# Altium schematic sheet HV_BUCK.SchDoc (part 2 of 2)
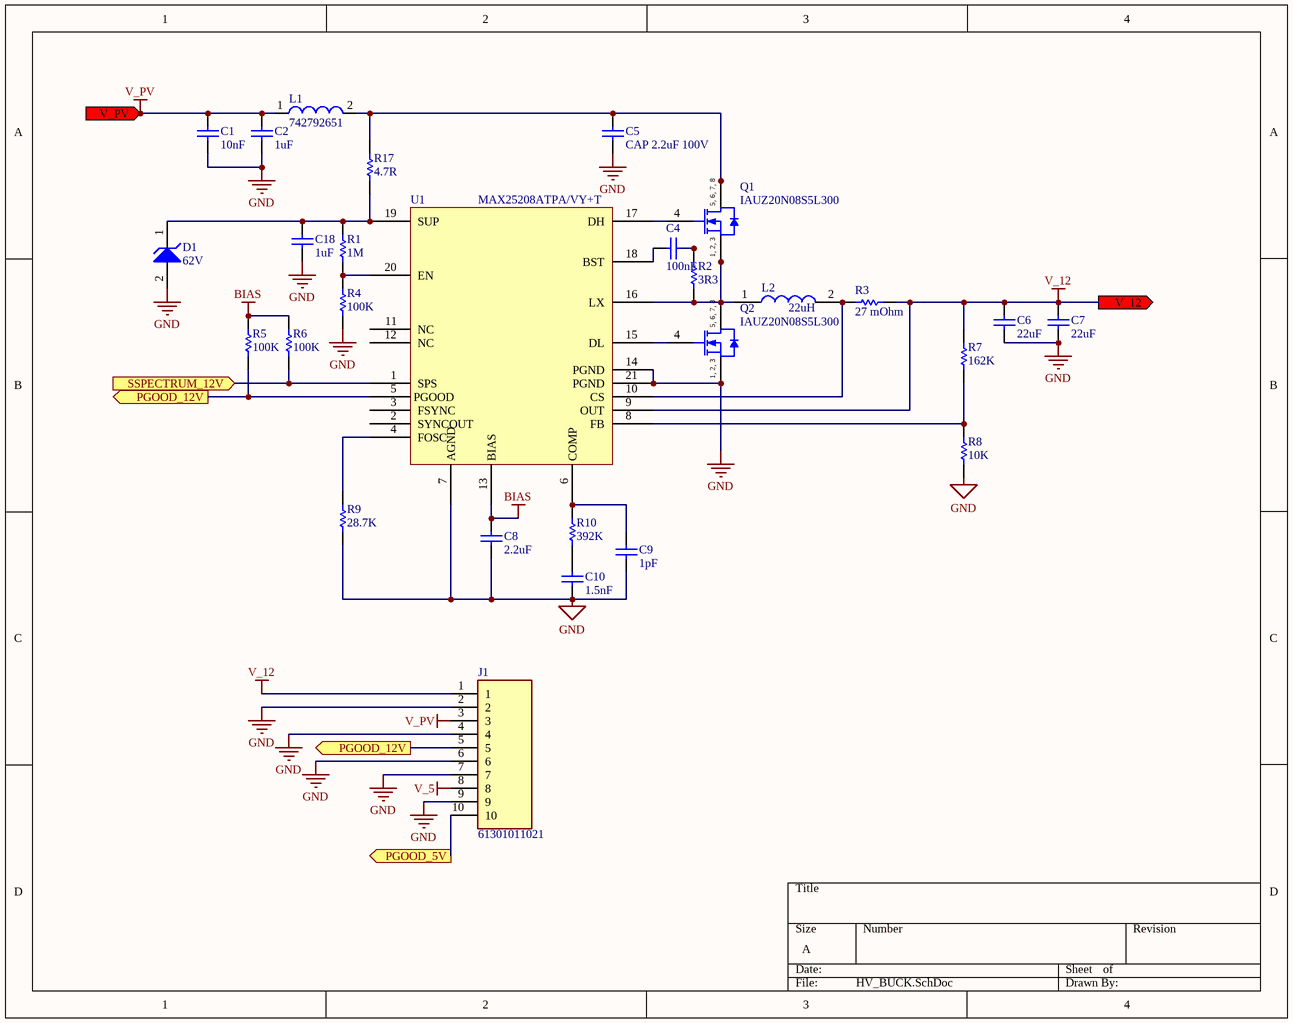
[diagram p1: HV_BUCK.SchDoc]

## Notes on the sheet
- (in symbol CMP-1091-00311-1) 5, 6, 7, 8; 1, 2, 3

## Library data of the parts
C1 = CMP-2007-04169-1: Cap Ceramic 0.01uF 100V X7R 10% SMD 0805 FlexiTerm 125C Paper T/R; Manufacturer: AVX Interconnect / Elco; Part Number: 08051C103KAZ2A; Dissipation Factor: 2.5%; Temperature Coefficient: 30ppm/°C; Supplier 1: Digi-Key; Supplier Part Number 1: 478-3559-1-ND; Manufacturer Part Number: 08051C103KAZ2A; RoHS: Yes; Category: Ceramic Capacitors; Stock 1: 40; Pricing 1: 1=0.27000, 10=0.18200, 50=0.10880, 100=0.09200, 500=0.06292, 1000=0.05566 (USD); Mount: Surface Mount; Case/Package: 0805; Number of Pins: 2; Case Code (Metric): 2012; Case Code (Imperial): 0805; Min Operating Temperature: -55°C; Max Operating Temperature: 125°C; Capacitance: 10nF; Tolerance: 10%; Packaging: Tape and Reel; Package Quantity: 1; Dielectric: X7R; Series: FLEXITERM®; Voltage Rating: 100V; Voltage Rating (DC): 100V; Termination: SMD/SMT; Construction: Flat; Voltage: 100V; Features: Soft Termination; Length: 2.01mm; Width: 0.049inch; Height: 0.94mm; Depth: 1.25mm; Thickness: 0.037inch; Radiation Hardening: No; RoHS Compliant: Yes; REACH SVHC: No SVHC; Lead Free: Lead Free; ComponentLink1URL: https://datasheet.ciiva.com/26904/getdatasheetpartid-136837-26904192.pdf?src-supplier=Verical; ComponentLink1Description: https://datasheet.ciiva.com/26904/getdatasheetpartid-136837-26904192.pdf?src-supplier=Verical; ComponentLink2URL: https://datasheet.ciiva.com/11787/0900766b80dc2409-11787665.pdf?src-supplier=RSComponents; ComponentLink2Description: https://datasheet.ciiva.com/11787/0900766b80dc2409-11787665.pdf?src-supplier=RSComponents; ComponentLink3URL: https://datasheet.ciiva.com/151/flexiterm-151492.pdf?src-supplier=Digi-Key; ComponentLink3Description: https://datasheet.ciiva.com/151/flexiterm-151492.pdf?src-supplier=Digi-Key; ComponentLink4URL: https://datasheet.ciiva.com/151/flexiterm-151493.pdf?src-supplier=Digi-Key; ComponentLink4Description: https://datasheet.ciiva.com/151/flexiterm-151493.pdf?src-supplier=Digi-Key; ComponentLink5URL: https://datasheet.ciiva.com/16326/cx7r-16326741.pdf?src-supplier=Future+Electronics; ComponentLink5Description: https://datasheet.ciiva.com/16326/cx7r-16326741.pdf?src-supplier=Future+Electronics; ComponentLink6URL: https://datasheet.ciiva.com/151/flexiterm-151494.pdf?src-supplier=Digi-Key; ComponentLink6Description: https://datasheet.ciiva.com/151/flexiterm-151494.pdf?src-supplier=Digi-Key; ComponentLink7URL: https://datasheet.ciiva.com/16625/flexiterm-16625227.pdf?src-supplier=Avnet+Europe; ComponentLink7Description: https://datasheet.ciiva.com/16625/flexiterm-16625227.pdf?src-supplier=Avnet+Europe; ComponentLink8URL: https://datasheet.ciiva.com/11508/flexiterm-11508220.pdf?src-supplier=Avnet; ComponentLink8Description: https://datasheet.ciiva.com/11508/flexiterm-11508220.pdf?src-supplier=Avnet; ComponentLink9URL: https://datasheet.ciiva.com/5416/cx7r-218113-5416686.pdf?src-supplier=Mouser; ComponentLink9Description: https://datasheet.ciiva.com/5416/cx7r-218113-5416686.pdf?src-supplier=Mouser
C2 = CMP-1037-04728-2: Chip Capacitor, 1 uF, +/- 10%, 100 V, -55 to 125 degC, 1206 (3216 Metric), RoHS, Tape and Reel; Manufacturer: AVX; Capacitance: 1µF; Dielectric: X7R; Rated Voltage: 100V; Mounting Technology: SurfaceMount; Package Description: 2-Pin Surface Mount Device, Body 3.2 x 1.6 mm; Case Size/Dimension: 1206; Datasheet Version: 07/2016; Manufacturer URL: http://www.avx.com/; Package Reference: 1206; Datasheet URL: http://datasheets.avx.com/X7RDielectric.pdf; Tolerance (%): ±10%
C4 = CMP-2008-02800-1: AVX 0.1uF Multilayer Ceramic Capacitor (MLCC) 16 V dc 10% X7R dielectric 402 SMT max op. temp. +125C; Manufacturer: AVX Interconnect / Elco; Part Number: 0402YC104KAT2A; Voltage Rating: 16V; Supplier 1: Digi-Key; Supplier Part Number 1: 478-7888-1-ND; Manufacturer Part Number: 0402YC104KAT2A; RoHS: Yes; Category: Ceramic Capacitors; Stock 1: 72315; Pricing 1: 1=0.10000, 10=0.01600, 50=0.00860, 100=0.00700, 500=0.00500, 1000=0.00393, 2500=0.00358, 5000=0.00329 (USD); Mount: Surface Mount,PCB; Case/Package: 0402; Case Code (Metric): 1005; Case Code (Imperial): 0402; Dielectric Material: Ceramic; Contact Plating: Tin,Matte; Min Operating Temperature: -55°C; Max Operating Temperature: 125°C; Tolerance: 10%; Packaging: Tape and Reel; Capacitance: 100nF; Voltage Rating (DC): 16V; Dielectric: X7R; Voltage: 16V; Package Quantity: 1; Termination: SMD/SMT; Series: -; Construction: Flat; Length: 1mm; Width: 0.02inch; Height: 0.56mm; Thickness: 0.022inch; Depth: 0.5mm; Radiation Hardening: No; REACH SVHC: Unknown; RoHS Compliant: Yes; Lead Free: Lead Free; ComponentLink1URL: https://datasheet.ciiva.com/1123/1679506-1123956.pdf?src-supplier=Element14; ComponentLink1Description: https://datasheet.ciiva.com/1123/1679506-1123956.pdf?src-supplier=Element14; ComponentLink2URL: https://datasheet.ciiva.com/7614/cx7r-7614662.pdf?src-supplier=Digi-Key; ComponentLink2Description: https://datasheet.ciiva.com/7614/cx7r-7614662.pdf?src-supplier=Digi-Key; ComponentLink3URL: https://datasheet.ciiva.com/22693/1679506-22693578.pdf?src-supplier=Element14; ComponentLink3Description: https://datasheet.ciiva.com/22693/1679506-22693578.pdf?src-supplier=Element14; ComponentLink4URL: https://datasheet.ciiva.com/16623/cx7r-16623291.pdf?src-supplier=Avnet+Europe; ComponentLink4Description: https://datasheet.ciiva.com/16623/cx7r-16623291.pdf?src-supplier=Avnet+Europe; ComponentLink5URL: https://datasheet.ciiva.com/2987/cx7r-2987708.pdf?src-supplier=Avnet; ComponentLink5Description: https://datasheet.ciiva.com/2987/cx7r-2987708.pdf?src-supplier=Avnet; ComponentLink6URL: https://datasheet.ciiva.com/6265/cx7r-6265276.pdf?src-supplier=Digi-Key; ComponentLink6Description: https://datasheet.ciiva.com/6265/cx7r-6265276.pdf?src-supplier=Digi-Key; ComponentLink7URL: https://datasheet.ciiva.com/28613/1679506-28613260.pdf?src-supplier=Element14; ComponentLink7Description: https://datasheet.ciiva.com/28613/1679506-28613260.pdf?src-supplier=Element14; ComponentLink8URL: https://datasheet.ciiva.com/5411/cx7r-218113-5411197.pdf?src-supplier=Mouser; ComponentLink8Description: https://datasheet.ciiva.com/5411/cx7r-218113-5411197.pdf?src-supplier=Mouser; ComponentLink9URL: https://datasheet.ciiva.com/7709/1679506-7709566.pdf?src-supplier=Element14; ComponentLink9Description: https://datasheet.ciiva.com/7709/1679506-7709566.pdf?src-supplier=Element14
C5 = CMP-1038-02104-1: CAP 2.2uF 100V ±10% 1210 (3225 Metric) Thickness 2.8mm SMD; Case-Metric: 3225; Tolerance: Â±10%; Case-EIA: 1210; Rated Voltage: 100 V; Value: 2.2uF; Technology: SMT; Max Thickness: 2.8 mm
C6 C7 = CMP-2000-05478-1: Ceramic Capacitor, 25 V, 22 uF, +/-10%, -55 to 85 degC, 2-Pin SMD (1210), RoHS, Tape and Reel; Temperature Coefficient / Code: +/-15%; Case Height: 2.79mm; Brand: AVX; Case Width: 2.5mm; Tolerance: 10%; Voltage Rating: 25V; Dielectric: X5R; Case Length: 3.2mm; Type: StandardX5RMLCCs; Case Code - in: 1210; Packaging: Reel; Minimum Operating Temperature: -55C; Package Reference: 1210; Product Category: MultilayerCeramicCapacitorsMLCC-SMD/SMT; Package / Case: 1210(3225metric); Dimensions: 2.5mmWx3.2mmLx2.79mmH; Capacitance: 22uF; RoHS: Details; Manufacturer: AVX; Case Code - mm: 3225; Maximum Operating Temperature: +85C; Operating Temperature Range: -55Cto+85C; Mounting Technology: SurfaceMount; Product: GeneralTypeMLCCs; Manufacturer URL: http://www.avx.com/; Termination Style: SMD/SMT; Package Description: 2-Pin Surface Mount Device, Body 3.2 x 2.5 mm; Datasheet URL: http://datasheets.avx.com/cx5r.pdf; Datasheet Version: 05/2016; Voltage Rating DC: 25V; Factory Pack Quantity: 1000
C8 = CMP-2007-03455-1: Manufacturer: Murata; Part Number: GRM21BR71C225KA12L; Tolerance: 10%; Voltage Rating: 16V; Dielectric: X7R; Supplier 1: Digi-Key; Supplier Part Number 1: 490-3906-1-ND; Manufacturer Part Number: GRM21BR71C225KA12L; RoHS: Yes; Category: Ceramic Capacitors; Stock 1: 321; Pricing 1: 1=0.33000, 10=0.23000, 50=0.15300, 100=0.13010, 500=0.09184, 1000=0.08036 (USD); Mount: Surface Mount; Case/Package: 0805; Number of Pins: 2; Case Code (Imperial): 0805; Case Code (Metric): 2012; Min Operating Temperature: -55°C; Max Operating Temperature: 125°C; Capacitance: 2.2uF; Packaging: Tape and Reel; Voltage Rating (DC): 16V; Package Quantity: 1; Termination: SMD/SMT; Voltage: 16V; Series: GRM; Construction: Flat; Length: 2mm; Width: 1.25mm; Height: 1.25mm; Thickness: 0.053inch; Depth: 1.25mm; Radiation Hardening: No; REACH SVHC: No SVHC; RoHS Compliant: Yes; Lead Free: Lead Free; ComponentLink1URL: https://datasheet.ciiva.com/3777/97grm21br71c225ka1223-3777119.pdf?src-supplier=Arrow+Electronics; ComponentLink1Description: https://datasheet.ciiva.com/3777/97grm21br71c225ka1223-3777119.pdf?src-supplier=Arrow+Electronics; ComponentLink2URL: https://datasheet.ciiva.com/7937/608985-7937701.pdf?src-supplier=Element14; ComponentLink2Description: https://datasheet.ciiva.com/7937/608985-7937701.pdf?src-supplier=Element14; ComponentLink3URL: https://datasheet.ciiva.com/5416/product-5416103.pdf?src-supplier=Mouser; ComponentLink3Description: https://datasheet.ciiva.com/5416/product-5416103.pdf?src-supplier=Mouser; ComponentLink4URL: https://datasheet.ciiva.com/11615/product-11615451.pdf?src-supplier=Avnet; ComponentLink4Description: https://datasheet.ciiva.com/11615/product-11615451.pdf?src-supplier=Avnet; ComponentLink5URL: https://datasheet.ciiva.com/16440/product-16440619.pdf?src-supplier=Future+Electronics; ComponentLink5Description: https://datasheet.ciiva.com/16440/product-16440619.pdf?src-supplier=Future+Electronics; ComponentLink6URL: https://datasheet.ciiva.com/137/partnumbering-e-01-137677.pdf?src-supplier=Digi-Key; ComponentLink6Description: https://datasheet.ciiva.com/137/partnumbering-e-01-137677.pdf?src-supplier=Digi-Key; ComponentLink7URL: https://datasheet.ciiva.com/137/partnumbering-e-01-137678.pdf?src-supplier=Digi-Key; ComponentLink7Description: https://datasheet.ciiva.com/137/partnumbering-e-01-137678.pdf?src-supplier=Digi-Key; ComponentLink8URL: https://datasheet.ciiva.com/137/partnumbering-e-01-137679.pdf?src-supplier=Digi-Key; ComponentLink8Description: https://datasheet.ciiva.com/137/partnumbering-e-01-137679.pdf?src-supplier=Digi-Key
C9 = CMP-2100-03588-1: Chip Capacitor, 1 pF, +/- 0.25 pF, 50 V, -55 to 125 degC, 0402 (1005 Metric), RoHS, Tape and Reel; Manufacturer: Yageo; Manufacturer Part Number: CC0402CRNPO9BN1R0; Tolerance: 5%; Dielectric: C0G; Insulation Resistance: 100GR; Voltage Rating: 50V; Dielectric Material: Ceramic; Min Operating Temperature: -55degC; Manufacturer URL: http://www.yageo.com/; Radiation Hardening: No; Capacitance: 1pF; Width: 0.02inch; REACH SVHC: NoSVHC; Termination: SMD/SMT; Composition: Ceramic; Mount: SurfaceMount; Height: 0.5mm; Case Code (Imperial): 0402; Thickness: 0.022inch; Case Code (Metric): 1005; Lead Free: LeadFree; Voltage Rating (DC): 50V; Length: 1mm; Depth: 0.5mm; Package Description: 2-Pin Surface Mount Device, Body 1 x 0.5 mm; Case/Package: 0402; Datasheet URL: http://www.yageo.com/documents/recent/UPY-GP_NP0_16V-to-50V_14.pdf; Packaging: TapeandReel; Max Operating Temperature: 125degC; Package Quantity: 10000; Package Reference: 0402; RoHSCompliant: True; Datasheet Version: Rev. 14, 07/2016; Supplier 1: Digi-Key; Supplier Part Number 1: 311-2076-1-ND; RoHS: Yes; Category: Ceramic Capacitors; Stock 1: 254020; Pricing 1: 1=0.10000, 10=0.02700, 50=0.01500, 100=0.01220, 500=0.00870, 1000=0.00683, 2500=0.00621, 5000=0.00571 (USD); Series: CC; Construction: Flat; Resistor Type: Ceramic; RoHS Compliant: Yes; ComponentLink1URL: https://datasheet.ciiva.com/17437/upy-gp-np0-16v-to-50v-8-17437445.pdf?src-supplier=Avnet+Europe; ComponentLink1Description: https://datasheet.ciiva.com/17437/upy-gp-np0-16v-to-50v-8-17437445.pdf?src-supplier=Avnet+Europe; ComponentLink2URL: https://datasheet.ciiva.com/8033/1443161-8033590.pdf?src-supplier=Element14; ComponentLink2Description: https://datasheet.ciiva.com/8033/1443161-8033590.pdf?src-supplier=Element14; ComponentLink3URL: https://datasheet.ciiva.com/11587/upy-gp-np0-16v-to-50v-8-11587159.pdf?src-supplier=Avnet; ComponentLink3Description: https://datasheet.ciiva.com/11587/upy-gp-np0-16v-to-50v-8-11587159.pdf?src-supplier=Avnet; ComponentLink4URL: https://datasheet.ciiva.com/17437/upy-gp-np0-16v-to-50v-8-17437447.pdf?src-supplier=Avnet+Europe; ComponentLink4Description: https://datasheet.ciiva.com/17437/upy-gp-np0-16v-to-50v-8-17437447.pdf?src-supplier=Avnet+Europe; ComponentLink5URL: https://datasheet.ciiva.com/176/mlccorderingcode-176344.pdf?src-supplier=Digi-Key; ComponentLink5Description: https://datasheet.ciiva.com/176/mlccorderingcode-176344.pdf?src-supplier=Digi-Key; ComponentLink6URL: https://datasheet.ciiva.com/7656/1132289-7656600.pdf?src-supplier=Element14; ComponentLink6Description: https://datasheet.ciiva.com/7656/1132289-7656600.pdf?src-supplier=Element14; ComponentLink7URL: https://datasheet.ciiva.com/11587/upy-gp-np0-16v-to-50v-8-11587161.pdf?src-supplier=Avnet; ComponentLink7Description: https://datasheet.ciiva.com/11587/upy-gp-np0-16v-to-50v-8-11587161.pdf?src-supplier=Avnet; ComponentLink8URL: https://datasheet.ciiva.com/13389/upy-gp-np0-16v-to-50v-8-13389355.pdf?src-supplier=Mouser; ComponentLink8Description: https://datasheet.ciiva.com/13389/upy-gp-np0-16v-to-50v-8-13389355.pdf?src-supplier=Mouser
C10 = CMP-2008-04642-1: Part Number: GRM155R71H152KA01D; Manufacturer: Murata; Material: Ceramic; Tolerance: 10%; Voltage Rating: 50V; Dielectric: X7R; Supplier 1: Digi-Key; Supplier Part Number 1: 490-3245-1-ND; Manufacturer Part Number: GRM155R71H152KA01D; RoHS: Yes; Category: Ceramic Capacitors; Stock 1: 353359; Pricing 1: 1=0.10000, 10=0.02200, 50=0.01180, 100=0.00960, 500=0.00686, 1000=0.00538, 2500=0.00490, 5000=0.00450 (USD); Mount: Surface Mount; Case/Package: 0402; Number of Pins: 2; Case Code (Imperial): 0402; Case Code (Metric): 1005; Min Operating Temperature: -55°C; Max Operating Temperature: 125°C; Capacitance: 1.5nF; Packaging: Tape and Reel; Package Quantity: 10000; Voltage Rating (DC): 50V; Termination: SMD/SMT; Voltage: 50V; Length: 1mm; Width: 0.5mm; Height: 0.5mm; Thickness: 0.022inch; Depth: 0.5mm; Radiation Hardening: No; RoHS Compliant: Yes; Lead Free: Lead Free; REACH SVHC: No SVHC; ComponentLink1URL: https://datasheet.ciiva.com/18184/getdatasheetpartid-153042-18184727.pdf?src-supplier=Verical; ComponentLink1Description: https://datasheet.ciiva.com/18184/getdatasheetpartid-153042-18184727.pdf?src-supplier=Verical; ComponentLink2URL: https://datasheet.ciiva.com/19476/1856441-19476519.pdf?src-supplier=Jameco; ComponentLink2Description: https://datasheet.ciiva.com/19476/1856441-19476519.pdf?src-supplier=Jameco; ComponentLink3URL: https://datasheet.ciiva.com/129/grm155r71h152ka01-01-129756.pdf?src-supplier=Digi-Key; ComponentLink3Description: https://datasheet.ciiva.com/129/grm155r71h152ka01-01-129756.pdf?src-supplier=Digi-Key; ComponentLink4URL: https://datasheet.ciiva.com/129/grm155r71h152ka01-01-129757.pdf?src-supplier=Digi-Key; ComponentLink4Description: https://datasheet.ciiva.com/129/grm155r71h152ka01-01-129757.pdf?src-supplier=Digi-Key; ComponentLink5URL: https://datasheet.ciiva.com/129/grm155r71h152ka01-01-129758.pdf?src-supplier=Digi-Key; ComponentLink5Description: https://datasheet.ciiva.com/129/grm155r71h152ka01-01-129758.pdf?src-supplier=Digi-Key; ComponentLink6URL: https://datasheet.ciiva.com/29199/454238-da-01-en-vs-kondensator-0402-29199743.pdf?src-supplier=Conrad; ComponentLink6Description: https://datasheet.ciiva.com/29199/454238-da-01-en-vs-kondensator-0402-29199743.pdf?src-supplier=Conrad; ComponentLink7URL: https://datasheet.ciiva.com/22698/608985-22698421.pdf?src-supplier=Element14; ComponentLink7Description: https://datasheet.ciiva.com/22698/608985-22698421.pdf?src-supplier=Element14; ComponentLink8URL: https://datasheet.ciiva.com/7937/608985-7937626.pdf?src-supplier=Element14; ComponentLink8Description: https://datasheet.ciiva.com/7937/608985-7937626.pdf?src-supplier=Element14; ComponentLink9URL: https://datasheet.ciiva.com/2989/product-2989403.pdf?src-supplier=Avnet; ComponentLink9Description: https://datasheet.ciiva.com/2989/product-2989403.pdf?src-supplier=Avnet; ComponentLink10URL: https://datasheet.ciiva.com/14116/grmseries-highdielectrictype-eng-14116907.pdf?src-supplier=Distrelec; ComponentLink10Description: https://datasheet.ciiva.com/14116/grmseries-highdielectrictype-eng-14116907.pdf?src-supplier=Distrelec; ComponentLink11URL: https://datasheet.ciiva.com/16199/product-16199179.pdf?src-supplier=Future+Electronics; ComponentLink11Description: https://datasheet.ciiva.com/16199/product-16199179.pdf?src-supplier=Future+Electronics; ComponentLink12URL: https://datasheet.ciiva.com/14116/grmseries-highdielectrictype-eng-14116846.pdf?src-supplier=Distrelec; ComponentLink12Description: https://datasheet.ciiva.com/14116/grmseries-highdielectrictype-eng-14116846.pdf?src-supplier=Distrelec
C18 = CMP-2000-05454-1: Chip Capacitor, 1 uF, +/- 10%, 100 V, -55 to 125 degC, 0805 (2012 Metric), RoHS, Tape and Reel; PCN Part Number: MLCCPartNumberChange30/Nov/2012; Manufacturer: TDK; Manufacturer Part Number: C2012X7S2A105K125AB; Other Names: 445-5205-1; Online Catalog: CSeries,MidVoltage; Capacitance: 1µF; Voltage - Rated: 100V; Temperature Coefficient: X7S; Featured Product: Compact,High-CapacitanceMultilayerCeramicChipCapacitorsMidVoltageX7S-100VMLCCsC-SeriesMidVoltageMLCCs; Kits: 445-9009-KIT-ND-KITCAPCERHICAP100V-630VSMDSAMPLEKIT1008-ND-KITCAPCERMLCC100V-630V; Catalog Drawings: CSERIES_2012-0805_1.45; Product Training Modules: SEAT,CCV,andTVCLDesignToolsCSeriesMidVoltageCapacitorsFamilyGuidetoReplacinganElectrolyticCapacitorwithanMLCC; Manufacturer URL: http://www.tdk.com/; Series: C; Ratings: -; Datasheet Version: Sep-13; Operating Temperature: -55degC~125degC; Lead Spacing: -; RoHS Information: RoHSCertificate-MLCC; Mounting Type: SurfaceMount,MLCC; Package Reference: 805; Thickness (Max): 0.053"(1.35mm); Category: Capacitors; Lead Style: -; Package Description: 2-Pin Surface Mount Device, Body 2 x 1.25 mm; Family: CeramicCapacitors; Features: -; Applications: GeneralPurpose; Package / Case: 0805(2012Metric); Standard Package: 1; Size / Dimension: 0.079"Lx0.049"W(2.00mmx1.25mm); Height - Seated (Max): -; Datasheet URL: https://datasheet.ciiva.com/24216/c2012x7s2a105k125ab-265082-24216433.pdf; Tolerance: ±10%; Packaging: CutTape(CT); Supplier 1: Digi-Key; Supplier Part Number 1: 445-5205-1-ND; RoHS: Yes; Stock 1: 274957; Pricing 1: 1=0.50000, 10=0.34500, 50=0.24160, 100=0.20700, 500=0.15524, 1000=0.13110 (USD); Mount: Surface Mount; Case/Package: 0805; Number of Pins: 2; Case Code (Imperial): 0805; Case Code (Metric): 2012; Weight: 0.000194oz; Min Operating Temperature: -55°C; Max Operating Temperature: 125°C; Voltage Rating: 100V; Voltage Rating (DC): 100V; Dielectric: X7S; Package Quantity: 1; Termination: SMD/SMT; Resistor Type: Ceramic; Voltage: 100V; Length: 2mm; Width: 1.25mm; Height: 1.25mm; Thickness: 0.053inch; Depth: 1.25mm; RoHS Compliant: Yes; Lead Free: Lead Free; REACH SVHC: No SVHC; ComponentLink1URL: https://datasheet.ciiva.com/24216/c2012x7s2a105k125ab-265082-24216433.pdf?src-supplier=Mouser; ComponentLink1Description: https://datasheet.ciiva.com/24216/c2012x7s2a105k125ab-265082-24216433.pdf?src-supplier=Mouser; ComponentLink2URL: https://datasheet.ciiva.com/16427/newmlccproducts-16427795.pdf?src-supplier=Future+Electronics; ComponentLink2Description: https://datasheet.ciiva.com/16427/newmlccproducts-16427795.pdf?src-supplier=Future+Electronics; ComponentLink3URL: https://datasheet.ciiva.com/8079/1833281-8079405.pdf?src-supplier=Element14; ComponentLink3Description: https://datasheet.ciiva.com/8079/1833281-8079405.pdf?src-supplier=Element14
D1 = CMP-1060-00431-1: Zener Voltage Regulator, 500 mW, 2-Pin SOD-123, Pb-Free, Tape and Reel; Manufacturer: On Semiconductor; PartNumber: SZMMSZ5265BT1G; VZ Typ (V): 62; P Max (W): 0.5; Max Power Dissipation: 500mW; Element Configuration: Single; Max Reverse Leakage Current: 100nA; Tolerance: 5%; Impedance: 185R; Test Current: 2mA; Packing: Tape and Reel; ComponentLink2URL: http://www.onsemi.cn/pub_link/Collateral/MMSZ5221BT1-D.PDF; DatasheetVersion: Rev. 12; Mounting Technology: Surface Mount; ComponentLink2Description: Datasheet; ComponentLink1Description: Manufacturer URL; ComponentLink3Description: Package Specification; ComponentLink1URL: http://www.onsemi.com/; PackageVersion: Rev. G, 10/2009; RoHS: Pb-Free; PackageDescription: 2-Pin SOD, Body 1.6 x 2.69 mm; ComponentLink3URL: http://www.onsemi.com/pub_link/Collateral/425-04.PDF; PackageReference: SOD-123-2-425-04; Supplier 1: Digi-Key; Supplier Part Number 1: SZMMSZ5265BT1GOSCT-ND; Manufacturer Part Number: SZMMSZ5265BT1G; Category: Zener Diodes; Stock 1: 15621; Pricing 1: 1=0.37000, 10=0.25800, 100=0.13010, 500=0.10614, 1000=0.07875 (USD); Case/Package: SOD-123-2; Number of Pins: 2; Min Operating Temperature: -55°C; Max Operating Temperature: 150°C; Package Quantity: 3000; Packaging: Tape and Reel; Zener Voltage: 62V; Voltage Tolerance: 5%; Length: 2.84mm; Width: 1.8mm; Height: 1.25mm; Radiation Hardening: No; Lead Free: Lead Free; RoHS Compliant: Yes; ComponentLink4URL: https://datasheet.ciiva.com/900/mmsz5221bt1-d-900256.pdf?src-supplier=Digi-Key; ComponentLink4Description: https://datasheet.ciiva.com/900/mmsz5221bt1-d-900256.pdf?src-supplier=Digi-Key; ComponentLink5URL: https://datasheet.ciiva.com/10638/mmsz5221bt1-d-10638351.pdf?src-supplier=Avnet; ComponentLink5Description: https://datasheet.ciiva.com/10638/mmsz5221bt1-d-10638351.pdf?src-supplier=Avnet
J1 = 61301011021: Connector; Manufacturer_Name: Wurth Elektronik; Datasheet Link: http://katalog.we-online.de/em/datasheet/6130xx11021.pdf; Height: 2.54mm; Manufacturer_Part_Number: 61301011021; Mouser Part Number: 710-61301011021; Mouser Price/Stock: https://www.mouser.co.uk/ProductDetail/Wurth-Elektronik/61301011021/?qs=ZtY9WdtwX54YO5vJhQZSew%3D%3D
L1 = CMP-0220-00181-1: SMD EMI Suppression Ferrite Bead WE-CBF, Z = 600 Ohm; Manufacturer: Wurth Electronics; Impedance: 600 Ohm; Tolerance: 25%; Current Rating: 1A; Number of Lines: 1; DC Resistance (DCR): 200mR; Test Frequency: 100MHz; Inductance: 0.36H; PackageReference: SMD-0603; PackageVersion: 2009; ComponentLink2Description: Datasheet; ComponentLink1Description: Manufacturer Link; ComponentLink2URL: http://www.we-online.de/katalog/media/pdf/742792651.pdf; DatasheetVersion: Dec-2005; ComponentLink1URL: http://www.we-online.com; PackageDescription: Chip Inductor, 2-Leads, Body 1.6 x 0.8 mm; Supplier 1: Digi-Key; Supplier Part Number 1: 732-1593-1-ND; Manufacturer Part Number: 742792651; RoHS: Yes; Category: Ferrite Beads and Chips; Stock 1: 132361; Pricing 1: 1=0.17000, 50=0.16800, 100=0.15500, 500=0.14800, 1000=0.14100, 2000=0.13400 (USD); Mount: Surface Mount; Case/Package: SMD/SMT; Core Material: Ferrite; Case Code (Metric): 1608; Case Code (Imperial): 0603; Material: Ferrite; Weight: 0.000141oz; Min Operating Temperature: -55°C; Max Operating Temperature: 125°C; Package Quantity: 1; Packaging: Tape and Reel; Max Current Rating: 1A; Max DC Current: 1A; Termination: SMD/SMT; Series: WE-CBF; Resistance: 200mR; Length: 1.6mm; Width: 0.8mm; Height: 0.8mm; Depth: 0.8mm; REACH SVHC: Unknown; RoHS Compliant: Yes; Lead Free: Lead Free; ComponentLink3URL: https://datasheet.ciiva.com/11803/0900766b80d2e079-11803680.pdf?src-supplier=RSComponents; ComponentLink3Description: https://datasheet.ciiva.com/11803/0900766b80d2e079-11803680.pdf?src-supplier=RSComponents; ComponentLink4URL: https://datasheet.ciiva.com/1475/1705833-1475349.pdf?src-supplier=Farnell; ComponentLink4Description: https://datasheet.ciiva.com/1475/1705833-1475349.pdf?src-supplier=Farnell; ComponentLink5URL: https://datasheet.ciiva.com/1013/742792651-1013527.pdf?src-supplier=Digi-Key; ComponentLink5Description: https://datasheet.ciiva.com/1013/742792651-1013527.pdf?src-supplier=Digi-Key; ComponentLink6URL: https://datasheet.ciiva.com/4940/742792651-72243-4940492.pdf?src-supplier=Mouser; ComponentLink6Description: https://datasheet.ciiva.com/4940/742792651-72243-4940492.pdf?src-supplier=Mouser; ComponentLink7URL: https://datasheet.ciiva.com/1013/742792651-1013528.pdf?src-supplier=Digi-Key; ComponentLink7Description: https://datasheet.ciiva.com/1013/742792651-1013528.pdf?src-supplier=Digi-Key; ComponentLink8URL: https://datasheet.ciiva.com/1013/742792651-1013529.pdf?src-supplier=Digi-Key; ComponentLink8Description: https://datasheet.ciiva.com/1013/742792651-1013529.pdf?src-supplier=Digi-Key; ComponentLink9URL: https://datasheet.ciiva.com/22711/1705833-22711420.pdf?src-supplier=Element14; ComponentLink9Description: https://datasheet.ciiva.com/22711/1705833-22711420.pdf?src-supplier=Element14
L2 = MPX1D0840L470: Inductor 22uH; Manufacturer_Name: Kemet; Manufacturer_Part_Number: MPX1D0840L220; Datasheet Link: https://componentsearchengine.com/Datasheets/1/MPX1D0840L470.pdf; Height: 4mm; Mouser Part Number: 80-MPX1D0840L220; Mouser Price/Stock: https://www.mouser.com/Search/Refine.aspx?Keyword=80-MPX1D0840L470
Q1 Q2 = CMP-1091-00311-1: N-Channel OptiMOS 3 Power-Transistor, 80 V VDS, 23 A ID, -55 to 150 degC, PG-TSDSON-8-1, Reel, Green; Manufacturer: Infineon; IDpuls (max): 92Â A; Green: TRUE; VGS(th) (min): 2Â V; QG: 6.8Â nC; Ptot (max): 32Â W; RDS (on) (max): 34Â mOhm; RDS (on) (max) (@4.5V): 66Â mOhm; Rth: 3.9Â K/W; VGS(th) (max): 3.5Â V; RthJA (max): 60 K/W; Polarity: N; ID (max): 23Â A; VDS (max): 80Â V; PackageVersion: Rev. 02, 09/2008; PackageReference: PG-TSDSON-8-1; PackageDescription: 8-Pin Plastic (Green) Thin Dual Small Outline Non-Leaded Package, 3.3 x 3.3 mm Body, 0.65 mm Pitch; DatasheetVersion: Rev. 2.3; PartNumber: IAUZ20N08S5L300; Mounting Technology: Surface Mount; ComponentLink1Description: Manufacturer URL; ComponentLink2Description: Datasheet; ComponentLink3URL: http://www.infineon.com/dgdl/BSZ240N12NS3+Rev2.0.pdf?folderId=db3a304313b8b5a60113cee8763b02d7&fileId=db3a30432a40a650012a42f3057a0038; Packing: Reel; ComponentLink1URL: http://www.infineon.com/; RthJC (max): 3.9Â K/W; ComponentLink3Description: Package Specification; Halogen-free: TRUE; ComponentLink2URL: http://www.infineon.com/dgdl/BSZ340N08NS3G_rev2.3.pdf?folderId=db3a304313b8b5a60113cee8763b02d7&fileId=db3a30431ff9881501206626660b6c72
R1 = CMP-2000-04829-1: RES SMD 1M OHM 1% 1/10W 0603; Manufacturer: Yageo; Part Number: AC0603FR-071ML; Resistance: 1MR; Power Rating: 100mW; Temperature Coefficient: 100ppm/°C; Voltage Rating: 50V; Supplier 1: Digi-Key; Supplier Part Number 1: 311-1MLDCT-ND; Manufacturer Part Number: AC0603FR-071ML; RoHS: Yes; Category: Chip SMD Resistors; Stock 1: 1569; Pricing 1: 1=0.10000, 10=0.02900, 100=0.01170, 1000=0.00527, 2500=0.00458 (USD); Case/Package: 0603; Case Code (Metric): 1608; Case Code (Imperial): 0603; Min Operating Temperature: -55°C; Max Operating Temperature: 155°C; Tolerance: 1%; Packaging: Tape and Reel; Resistor Type: Thick Film; Number of Terminations: 2; Max Power Dissipation: 100mW; Series: AC; Package Quantity: 1; Termination: SMD/SMT; Features: Moisture Resistant,Automotive AEC-Q200,Anti-Sulfur; Length: 0.063inch; Width: 0.031inch; Height: 0.022inch; RoHS Compliant: Yes; Lead Free: Lead Free; ComponentLink1URL: https://datasheet.ciiva.com/5562/pyu-ac-51-rohs-l-2-5562551.pdf?src-supplier=Mouser; ComponentLink1Description: https://datasheet.ciiva.com/5562/pyu-ac-51-rohs-l-2-5562551.pdf?src-supplier=Mouser
R2 = CMP-2002-07060-1: Res Thick Film 0402 3.3 Ohm 1% 1/16W ±200ppm/°C Molded SMD Paper T/R; Manufacturer: Yageo / Phycomp; Part Number: RC0402FR-073R3L; Power Rating: 63mW; Resistance: 3.3R; Voltage Rating: 50V; Supplier 1: Digi-Key; Supplier Part Number 1: 311-3.30LRCT-ND; Manufacturer Part Number: RC0402FR-073R3L; RoHS: Yes; Category: Chip SMD Resistors; Stock 1: 461211; Pricing 1: 1=0.10000, 10=0.02400, 100=0.00960, 1000=0.00431, 2500=0.00374, 5000=0.00309 (USD); Case/Package: 0402; Case Code (Imperial): 0402; Case Code (Metric): 1005; Contact Plating: Tin,Matte; Size Code: 0402; Min Operating Temperature: -55°C; Max Operating Temperature: 155°C; Tolerance: 1%; Packaging: Tape and Reel; Resistor Type: Thick Film; Temperature Coefficient: 200ppm/°C; Series: RC; Max Power Dissipation: 63mW; Number of Terminations: 2; Construction: Rectangular; Voltage Rating (DC): 50V; Features: Moisture Resistant; Termination: SMD/SMT; Resistance Tolerance: 1%; Length: 1mm; Depth: 0.5mm; RoHS Compliant: Yes; Military Standard: Not; Lead Free: Lead Free; REACH SVHC: Unknown; ComponentLink1URL: https://datasheet.ciiva.com/28412/pyu-rc0402-51-rohs-l-6-28412729.pdf?src-supplier=Avnet+Europe; ComponentLink1Description: https://datasheet.ciiva.com/28412/pyu-rc0402-51-rohs-l-6-28412729.pdf?src-supplier=Avnet+Europe; ComponentLink2URL: https://datasheet.ciiva.com/16856/pyu-rc0402-51-rohs-l-6-16856956.pdf?src-supplier=Avnet+Europe; ComponentLink2Description: https://datasheet.ciiva.com/16856/pyu-rc0402-51-rohs-l-6-16856956.pdf?src-supplier=Avnet+Europe; ComponentLink3URL: https://datasheet.ciiva.com/7849/1018594-7849999.pdf?src-supplier=Element14; ComponentLink3Description: https://datasheet.ciiva.com/7849/1018594-7849999.pdf?src-supplier=Element14; ComponentLink4URL: https://datasheet.ciiva.com/8893/pyu-rc0402-51-rohs-l-6-8893711.pdf?src-supplier=Avnet; ComponentLink4Description: https://datasheet.ciiva.com/8893/pyu-rc0402-51-rohs-l-6-8893711.pdf?src-supplier=Avnet
R3 = CMP-2003-04053-1: Manufacturer: Yageo; Part Number: RL1206FR-070R027L; Resistance: 27mR; Power Rating: 250mW; Tolerance: 1%; Temperature Coefficient: 1200ppm/°C; Supplier 1: Digi-Key; Supplier Part Number 1: 311-.027LWCT-ND; Manufacturer Part Number: RL1206FR-070R027L; RoHS: Yes; Category: Chip SMD Resistors; Stock 1: 6389; Pricing 1: 1=0.70000, 10=0.54000, 100=0.22710, 1000=0.12530, 2500=0.11747 (USD); Case/Package: 1206; Case Code (Imperial): 1206; Case Code (Metric): 3216; Weight: 0.000571oz; Min Operating Temperature: -55°C; Max Operating Temperature: 125°C; Packaging: Tape and Reel; Resistor Type: Thick Film; Termination: SMD/SMT; Package Quantity: 5000; Features: Moisture Resistant,Automotive AEC-Q200; Series: RL; Technology: THICK FILM; Max Power Dissipation: 250mW; Number of Terminations: 2; Construction: Rectangular; Length: 3.1mm; Width: 1.6mm; Height: 0.55mm; Depth: 1.6mm; Military Standard: Not; RoHS Compliant: Yes; ComponentLink1URL: https://datasheet.ciiva.com/15328/pyu-rl-521-rohs-l-5-15328789.pdf?src-supplier=Mouser; ComponentLink1Description: https://datasheet.ciiva.com/15328/pyu-rl-521-rohs-l-5-15328789.pdf?src-supplier=Mouser
R4 = CMP-2100-03662-1: Chip Resistor, 100 KOhm, +/- 1%, 0.1 W, -55 to 155 degC, 0603 (1608 Metric), RoHS, Tape and Reel; Manufacturer: Yageo; Manufacturer Part Number: RC0603FR-07100KL; Power Rating: 100mW; Voltage Rating: 50V; Temperature Coefficient: 100ppm/degreesC; Working Voltage: 75V; Datasheet Version: Rev. 5, 10/2016; Height: 0.45mm; Lead Free: LeadFree; Manufacturer URL: http://www.yageo.com/; Package Reference: 0603; Depth: 0.8mm; RoHSCompliant: true; Composition: ThickFilm; Military Standard: Not; Resistance: 100KOhm; Case/Package: 0603; Packaging: TapeandReel; Case Code (Imperial): 0603; Voltage Rating (DC): 50V; Case Code (Metric): 1608; Tolerance: 1%; Termination: SMD/SMT; Min Operating Temperature: -55degC; Number of Pins: 2; Length: 1.6mm; Width: 0.8mm; Datasheet URL: http://www.yageo.com/NewPortal/yageodocoutput?fileName=/pdf/R-Chip/PYu-RC_Group_51_RoHS_L_5.pdf; Package Description: 2-Pin Surface Mount Device, Body 1.6 x 0.8 mm; Max Operating Temperature: 155degC; REACH SVHC: NoSVHC; Supplier 1: Digi-Key; Supplier Part Number 1: 311-100KHRCT-ND; RoHS: Yes; Category: Chip SMD Resistors; Stock 1: 19737322; Pricing 1: 1=0.10000, 10=0.02400, 100=0.00970, 1000=0.00436, 2500=0.00378 (USD); Series: RC; Max Power Dissipation: 100mW; Resistor Type: Thick Film; Number of Terminations: 2; Resistance Tolerance: 1%; Features: Moisture Resistant; Construction: Rectangular; Technology: THICK FILM; RoHS Compliant: Yes; ComponentLink1URL: https://datasheet.ciiva.com/11808/0900766b80f96399-11808107.pdf?src-supplier=RSComponents; ComponentLink1Description: https://datasheet.ciiva.com/11808/0900766b80f96399-11808107.pdf?src-supplier=RSComponents; ComponentLink2URL: https://datasheet.ciiva.com/7983/443971-7983593.pdf?src-supplier=Element14; ComponentLink2Description: https://datasheet.ciiva.com/7983/443971-7983593.pdf?src-supplier=Element14; ComponentLink3URL: https://datasheet.ciiva.com/46440/1868787-46440889.pdf?src-supplier=Element14; ComponentLink3Description: https://datasheet.ciiva.com/46440/1868787-46440889.pdf?src-supplier=Element14; ComponentLink4URL: https://datasheet.ciiva.com/7746/1738695-7746234.pdf?src-supplier=Element14; ComponentLink4Description: https://datasheet.ciiva.com/7746/1738695-7746234.pdf?src-supplier=Element14; ComponentLink5URL: https://datasheet.ciiva.com/7746/1738695-7746235.pdf?src-supplier=Element14; ComponentLink5Description: https://datasheet.ciiva.com/7746/1738695-7746235.pdf?src-supplier=Element14; ComponentLink6URL: https://datasheet.ciiva.com/22747/443971-22747516.pdf?src-supplier=Element14; ComponentLink6Description: https://datasheet.ciiva.com/22747/443971-22747516.pdf?src-supplier=Element14
R5 R6 = CMP-2002-07343-1: Res General Purpose Thick Film 0402 100K Ohm 1% 1/16W ±100ppm/°C Molded SMD Paper T/R; Part Number: RC0402FR-07100KL; Manufacturer: Yageo / Phycomp; Power Rating: 63mW; Resistance: 100kR; Voltage Rating: 50V; Supplier 1: Digi-Key; Supplier Part Number 1: 311-100KLRCT-ND; Manufacturer Part Number: RC0402FR-07100KL; RoHS: Yes; Category: Chip SMD Resistors; Stock 1: 17727422; Pricing 1: 1=0.10000, 10=0.01600, 100=0.00640, 1000=0.00286, 2500=0.00248, 5000=0.00205 (USD); Case/Package: 0402; Case Code (Metric): 1005; Case Code (Imperial): 0402; Min Operating Temperature: -55°C; Max Operating Temperature: 155°C; Tolerance: 1%; Packaging: Tape and Reel; Max Power Dissipation: 63mW; Series: RC; Package Quantity: 1; Termination: SMD/SMT; Resistance Tolerance: 1%; Resistor Type: Thick Film; Number of Terminations: 2; Temperature Coefficient: 100ppm/°C; Construction: Rectangular; Features: Moisture Resistant; Technology: THICK FILM; Working Voltage: 50V; Length: 0.039inch; Width: 0.02inch; Height: 0.016inch; Depth: 0.5mm; RoHS Compliant: Yes; REACH SVHC: No SVHC; Military Standard: Not; Lead Free: Lead Free; ComponentLink1URL: https://datasheet.ciiva.com/11819/0900766b80c66297-11819452.pdf?src-supplier=RSComponents; ComponentLink1Description: https://datasheet.ciiva.com/11819/0900766b80c66297-11819452.pdf?src-supplier=RSComponents; ComponentLink2URL: https://datasheet.ciiva.com/2453/pyu-r-int-thick-7-2453361.pdf?src-supplier=Digi-Key; ComponentLink2Description: https://datasheet.ciiva.com/2453/pyu-r-int-thick-7-2453361.pdf?src-supplier=Digi-Key; ComponentLink3URL: https://datasheet.ciiva.com/2453/pyu-r-int-thick-7-2453362.pdf?src-supplier=Digi-Key; ComponentLink3Description: https://datasheet.ciiva.com/2453/pyu-r-int-thick-7-2453362.pdf?src-supplier=Digi-Key; ComponentLink4URL: https://datasheet.ciiva.com/2453/pyu-r-int-thick-7-2453363.pdf?src-supplier=Digi-Key; ComponentLink4Description: https://datasheet.ciiva.com/2453/pyu-r-int-thick-7-2453363.pdf?src-supplier=Digi-Key; ComponentLink5URL: https://datasheet.ciiva.com/22747/1018594-22747509.pdf?src-supplier=Element14; ComponentLink5Description: https://datasheet.ciiva.com/22747/1018594-22747509.pdf?src-supplier=Element14; ComponentLink6URL: https://datasheet.ciiva.com/15189/getdatasheetpartid-323696-15189334.pdf?src-supplier=Verical; ComponentLink6Description: https://datasheet.ciiva.com/15189/getdatasheetpartid-323696-15189334.pdf?src-supplier=Verical; ComponentLink7URL: https://datasheet.ciiva.com/12667/pyu-rc0402-51-rohs-l-6-r-12667930.pdf?src-supplier=Mouser; ComponentLink7Description: https://datasheet.ciiva.com/12667/pyu-rc0402-51-rohs-l-6-r-12667930.pdf?src-supplier=Mouser
R7 = CMP-2002-07134-1: Part Number: RC0402FR-07162KL; Manufacturer: Yageo / Phycomp; Resistance: 162kR; Tolerance: 1%; Power Rating: 62.5mW; Temperature Coefficient: 100ppm/°C; Voltage Rating: 50V; Max Power Dissipation: 63mW; Supplier 1: Digi-Key; Supplier Part Number 1: YAG2370CT-ND; Manufacturer Part Number: RC0402FR-07162KL; RoHS: Yes; Category: Chip SMD Resistors; Stock 1: 611980; Pricing 1: 1=0.10000, 10=0.01600, 100=0.00660, 1000=0.00299, 2500=0.00259, 5000=0.00214 (USD); Case/Package: 0402; Case Code (Imperial): 0402; Case Code (Metric): 1005; Contact Plating: Tin,Matte; Size Code: 0402; Min Operating Temperature: -55°C; Max Operating Temperature: 155°C; Packaging: Tape and Reel; Resistor Type: Thick Film; Package Quantity: 10000; Termination: SMD/SMT; Voltage Rating (DC): 50V; Series: RC; Number of Terminations: 2; Features: Moisture Resistant; Construction: Rectangular; Length: 1mm; Width: 0.02inch; Height: 0.016inch; Depth: 0.5mm; RoHS Compliant: Yes; Lead Free: Lead Free; Military Standard: Not; ComponentLink1URL: https://datasheet.ciiva.com/16869/pyu-rc0402-51-rohs-l-6-16869191.pdf?src-supplier=Avnet+Europe; ComponentLink1Description: https://datasheet.ciiva.com/16869/pyu-rc0402-51-rohs-l-6-16869191.pdf?src-supplier=Avnet+Europe; ComponentLink2URL: https://datasheet.ciiva.com/2452/pyu-r-int-thick-7-2452605.pdf?src-supplier=Digi-Key; ComponentLink2Description: https://datasheet.ciiva.com/2452/pyu-r-int-thick-7-2452605.pdf?src-supplier=Digi-Key
R8 = CMP-2002-07353-1: Part Number: RC0402FR-0710KL; Manufacturer: Yageo / Phycomp; Resistance: 10kR; Power Rating: 62.5mW; Max Power Dissipation: 63mW; Tolerance: 1%; Voltage Rating: 50V; Temperature Coefficient: 100ppm/°C; Supplier 1: Digi-Key; Supplier Part Number 1: 311-10.0KLRCT-ND; Manufacturer Part Number: RC0402FR-0710KL; RoHS: Yes; Category: Chip SMD Resistors; Stock 1: 26492001; Pricing 1: 1=0.10000, 10=0.01600, 100=0.00660, 1000=0.00299, 2500=0.00259, 5000=0.00214 (USD); Case/Package: 0402; Number of Pins: 2; Case Code (Imperial): 0402; Case Code (Metric): 1005; Min Operating Temperature: -55°C; Max Operating Temperature: 155°C; Packaging: Tape and Reel; Termination: SMD/SMT; Series: RC; Resistance Tolerance: 1%; Resistor Type: Thick Film; Number of Terminations: 2; Features: Moisture Resistant; Construction: Rectangular; Voltage Rating (DC): 50V; Working Voltage: 50V; Length: 1mm; Width: 0.5mm; Height: 0.32mm; Depth: 0.5mm; Lead Pitch: 0.2mm; REACH SVHC: No SVHC; RoHS Compliant: Yes; Military Standard: Not; Lead Free: Lead Free; ComponentLink1URL: https://datasheet.ciiva.com/7660/38568-7660787.pdf?src-supplier=Element14; ComponentLink1Description: https://datasheet.ciiva.com/7660/38568-7660787.pdf?src-supplier=Element14; ComponentLink2URL: https://datasheet.ciiva.com/7849/1784430-7849813.pdf?src-supplier=Element14; ComponentLink2Description: https://datasheet.ciiva.com/7849/1784430-7849813.pdf?src-supplier=Element14; ComponentLink3URL: https://datasheet.ciiva.com/7849/1686128-7849814.pdf?src-supplier=Element14; ComponentLink3Description: https://datasheet.ciiva.com/7849/1686128-7849814.pdf?src-supplier=Element14; ComponentLink4URL: https://datasheet.ciiva.com/7849/1784430-7849815.pdf?src-supplier=Element14; ComponentLink4Description: https://datasheet.ciiva.com/7849/1784430-7849815.pdf?src-supplier=Element14; ComponentLink5URL: https://datasheet.ciiva.com/22747/1018594-22747512.pdf?src-supplier=Element14; ComponentLink5Description: https://datasheet.ciiva.com/22747/1018594-22747512.pdf?src-supplier=Element14; ComponentLink6URL: https://datasheet.ciiva.com/12667/pyu-rc0402-51-rohs-l-6-r-12667067.pdf?src-supplier=Mouser; ComponentLink6Description: https://datasheet.ciiva.com/12667/pyu-rc0402-51-rohs-l-6-r-12667067.pdf?src-supplier=Mouser; ComponentLink7URL: https://datasheet.ciiva.com/7983/1018594-7983486.pdf?src-supplier=Element14; ComponentLink7Description: https://datasheet.ciiva.com/7983/1018594-7983486.pdf?src-supplier=Element14
R9 = CMP-2002-00838-1: RES SMD 28.7K OHM 1% 1/10W 0402; Part Number: ERJ-2RKF2872X; Manufacturer: Panasonic; Resistance: 28.7kR; Temperature Coefficient: 100ppm/°C; Power Rating: 100mW; Voltage Rating: 50V; Supplier 1: Digi-Key; Supplier Part Number 1: P28.7KLCT-ND; Manufacturer Part Number: ERJ-2RKF2872X; RoHS: Yes; Category: Chip SMD Resistors; Stock 1: 33664; Pricing 1: 1=0.10000, 10=0.02500, 100=0.01020, 1000=0.00457, 2500=0.00397, 5000=0.00328 (USD); Mount: Surface Mount; Case/Package: 0402; Case Code (Metric): 1005; Case Code (Imperial): 0402; Contact Plating: Tin; Min Operating Temperature: -55°C; Max Operating Temperature: 155°C; Tolerance: 1%; Packaging: Tape and Reel; Resistor Type: Thick Film; Series: ERJ; Number of Terminations: 2; Termination: SMD/SMT; Max Power Dissipation: 100mW; Voltage Rating (DC): 50V; Package Quantity: 10000; Resistance Tolerance: 1%; Construction: Rectangular; Length: 1mm; Width: 0.02inch; Height: 0.016inch; Depth: 0.5mm; RoHS Compliant: Yes; Lead Free: Lead Free; Military Standard: Not; REACH SVHC: Unknown; ComponentLink1URL: https://datasheet.ciiva.com/16758/70260748-16758328.pdf?src-supplier=Allied+Electronics; ComponentLink1Description: https://datasheet.ciiva.com/16758/70260748-16758328.pdf?src-supplier=Allied+Electronics; ComponentLink2URL: https://datasheet.ciiva.com/28536/1694929-28536072.pdf?src-supplier=Element14; ComponentLink2Description: https://datasheet.ciiva.com/28536/1694929-28536072.pdf?src-supplier=Element14; ComponentLink3URL: https://datasheet.ciiva.com/16783/70260748-16783354.pdf?src-supplier=Allied+Electronics; ComponentLink3Description: https://datasheet.ciiva.com/16783/70260748-16783354.pdf?src-supplier=Allied+Electronics; ComponentLink4URL: https://datasheet.ciiva.com/24069/aoa0000ce2-24069212.pdf?src-supplier=Mouser; ComponentLink4Description: https://datasheet.ciiva.com/24069/aoa0000ce2-24069212.pdf?src-supplier=Mouser; ComponentLink5URL: https://datasheet.ciiva.com/46441/1678782-46441260.pdf?src-supplier=Element14; ComponentLink5Description: https://datasheet.ciiva.com/46441/1678782-46441260.pdf?src-supplier=Element14; ComponentLink6URL: https://datasheet.ciiva.com/30105/aoa0000ce2-30105661.pdf?src-supplier=Onlinecomponents.com; ComponentLink6Description: https://datasheet.ciiva.com/30105/aoa0000ce2-30105661.pdf?src-supplier=Onlinecomponents.com; ComponentLink7URL: https://datasheet.ciiva.com/9191/aoa0000ce2-9191054.pdf?src-supplier=Avnet; ComponentLink7Description: https://datasheet.ciiva.com/9191/aoa0000ce2-9191054.pdf?src-supplier=Avnet
R10 = CMP-1011-00803-2: Res Thick Film 0402 392K Ohm 1% 1/16W 100ppm/C Molded SMD Paper T/R; Manufacturer: Yageo; Part Number: RC0402FR07392KL; Manufacturer Part Number: RC0402FR-07392KL; Resistance: 392kR; Power Rating: 62.5mW; Temperature Coefficient: 100ppm/°C; Voltage Rating: 50V; Max Power Dissipation: 63mW; Supplier 1: Digi-Key; Supplier Part Number 1: YAG3144CT-ND; RoHS: Yes; Category: Chip SMD Resistors; Stock 1: 637; Pricing 1: 1=0.10000, 10=0.01600, 100=0.00660, 1000=0.00299, 2500=0.00259, 5000=0.00214 (USD); Case/Package: 0402; Case Code (Imperial): 0402; Case Code (Metric): 1005; Contact Plating: Tin,Matte; Size Code: 0402; Min Operating Temperature: -55°C; Max Operating Temperature: 155°C; Tolerance: 1%; Packaging: Tape and Reel; Resistor Type: Thick Film; Voltage Rating (DC): 50V; Number of Terminations: 2; Termination: SMD/SMT; Features: Moisture Resistant; Series: RC; Construction: Rectangular; Length: 1mm; Width: 0.02inch; Height: 0.016inch; Depth: 0.5mm; Lead Free: Lead Free; RoHS Compliant: Yes; Military Standard: Not; ComponentLink1URL: https://datasheet.ciiva.com/5558/pyu-rc0402-51-rohs-l-6-r-5558085.pdf?src-supplier=Mouser; ComponentLink1Description: https://datasheet.ciiva.com/5558/pyu-rc0402-51-rohs-l-6-r-5558085.pdf?src-supplier=Mouser; ComponentLink2URL: https://datasheet.ciiva.com/16857/pyu-rc0402-51-rohs-l-6-16857542.pdf?src-supplier=Avnet+Europe; ComponentLink2Description: https://datasheet.ciiva.com/16857/pyu-rc0402-51-rohs-l-6-16857542.pdf?src-supplier=Avnet+Europe; ComponentLink3URL: https://datasheet.ciiva.com/8885/pyu-rc0402-51-rohs-l-6-8885851.pdf?src-supplier=Avnet; ComponentLink3Description: https://datasheet.ciiva.com/8885/pyu-rc0402-51-rohs-l-6-8885851.pdf?src-supplier=Avnet; ComponentLink4URL: https://datasheet.ciiva.com/28390/pyu-rc0402-51-rohs-l-6-28390879.pdf?src-supplier=Avnet+Europe; ComponentLink4Description: https://datasheet.ciiva.com/28390/pyu-rc0402-51-rohs-l-6-28390879.pdf?src-supplier=Avnet+Europe
R17 = CMP-1665-00033-1: Chip Resistor, 4.7 Ohm, +/- 1%, 125 mW, -55 to 125 degC, 0805 (2012 Metric), RoHS, Tape and Reel; PartNumber: ERJ-6RQF4R7V; Manufacturer: Panasonic; Power Rating: 125 mW; Case\/Package: 0805; Resistance: 4.7 Ohm; Temperature Coefficient: 200ppm/°C; Max Power Dissipation: 125mW; Mount: Surface Mount; Length: 0.079 inch; Tolerance: 1%; REACH SVHC: No SVHC; PackageDescription: 2-Pin Surface Mount Device, Body 2 x 1.5 mm; ComponentLink1URL: http://www.panasonic.com/; Width: 0.049 inch; Min Operating Temperature: -55 degC; Height: 0.028 inch; Case Code (Metric): 2012; Mounting Technology: Surface Mount; Pins: 2; Max Operating Temperature: 125 degC; Packaging: Tape and Reel; ComponentLink2URL: http://industrial.panasonic.com/cdbs/www-data/pdf/RDA0000/AOA0000C86.pdf; RoHSCompliant: true; ComponentLink2Description: Datasheet; PackageReference: 0805; Package Quantity: 5000; ComponentLink1Description: Manufacturer URL; Radiation Hardening: No; Case Code (Imperial): 0805; DatasheetVersion: 04/2015; Supplier 1: Digi-Key; Supplier Part Number 1: P4.7DCT-ND; Manufacturer Part Number: ERJ-6RQF4R7V; RoHS: Yes; Category: Chip SMD Resistors; Stock 1: 7470; Pricing 1: 1=0.37000, 10=0.31100, 25=0.22640, 50=0.16420, 100=0.12170, 250=0.09340, 500=0.07358, 1000=0.05094 (USD); Case/Package: 0805; Number of Pins: 2; Contact Plating: Tin; Composition: Thick Film; Number of Terminations: 2; Termination: SMD/SMT; Military Standard: Not; Depth: 1.25mm; Lead Free: Lead Free; ComponentLink3URL: https://datasheet.ciiva.com/11818/0900766b80eefa12-11818492.pdf?src-supplier=RSComponents; ComponentLink3Description: https://datasheet.ciiva.com/11818/0900766b80eefa12-11818492.pdf?src-supplier=RSComponents; ComponentLink4URL: https://datasheet.ciiva.com/25711/391509-25711737.pdf?src-supplier=Farnell; ComponentLink4Description: https://datasheet.ciiva.com/25711/391509-25711737.pdf?src-supplier=Farnell; ComponentLink5URL: https://datasheet.ciiva.com/17213/aoa0000ce3-17213115.pdf?src-supplier=Avnet+Europe; ComponentLink5Description: https://datasheet.ciiva.com/17213/aoa0000ce3-17213115.pdf?src-supplier=Avnet+Europe; ComponentLink6URL: https://datasheet.ciiva.com/22746/391509-22746507.pdf?src-supplier=Element14; ComponentLink6Description: https://datasheet.ciiva.com/22746/391509-22746507.pdf?src-supplier=Element14; ComponentLink7URL: https://datasheet.ciiva.com/9195/aoa0000ce3-9195709.pdf?src-supplier=Avnet; ComponentLink7Description: https://datasheet.ciiva.com/9195/aoa0000ce3-9195709.pdf?src-supplier=Avnet; ComponentLink8URL: https://datasheet.ciiva.com/16761/70068852-16761070.pdf?src-supplier=Allied+Electronics; ComponentLink8Description: https://datasheet.ciiva.com/16761/70068852-16761070.pdf?src-supplier=Allied+Electronics; ComponentLink9URL: https://datasheet.ciiva.com/22730/391509-22730382.pdf?src-supplier=Element14; ComponentLink9Description: https://datasheet.ciiva.com/22730/391509-22730382.pdf?src-supplier=Element14; ComponentLink10URL: https://datasheet.ciiva.com/24026/aoa0000ce3-72189-24026846.pdf?src-supplier=Mouser; ComponentLink10Description: https://datasheet.ciiva.com/24026/aoa0000ce3-72189-24026846.pdf?src-supplier=Mouser; ComponentLink11URL: https://datasheet.ciiva.com/30074/6aoa0000ce3-30074670.pdf?src-supplier=Onlinecomponents.com; ComponentLink11Description: https://datasheet.ciiva.com/30074/6aoa0000ce3-30074670.pdf?src-supplier=Onlinecomponents.com
U1 = MAX25208: Industry's Lowest 70V IQ Automotive Synchronous Step-Down Controller Uses Only 7µA of Quiescent Current; Manufacturer: Maxim Integrated; Supplier 1: Avnet; Manufacturer Part Number: MAX25208ATPA/VY+T; Pricing 1: 2500=2.19325, 5000=2.16225, 10000=2.13125, 15000=2.10025, 20000=2.06925, 25000=2.03825, 250000=2.00725 (USD); ComponentLink1URL: http://datasheet.octopart.com/MAX25208ATPA-VY%2BT-Maxim-Integrated-datasheet-150864306.pdf?src-supplier=Ciiva+Crawler; ComponentLink1Description: http://datasheet.octopart.com/MAX25208ATPA-VY%2BT-Maxim-Integrated-datasheet-150864306.pdf?src-supplier=Ciiva+Crawler